# Altium schematic sheet EntradasAnalogicas.SchDoc
size A4; SheetNumber: 7; SheetTotal: 8
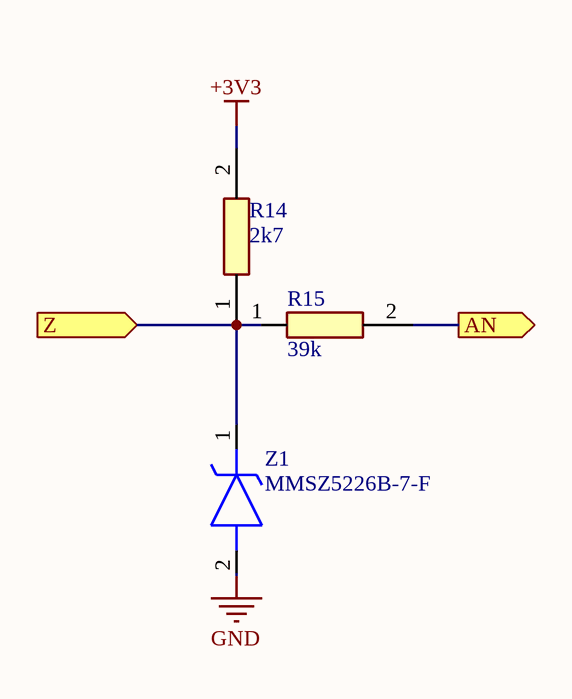
[diagram p0: EntradasAnalogicas.SchDoc]

## Parts
R14  2k7  [RESC3216X75N]
R15  39k  [RESC3216X75N]
Z1  MMSZ5226B-7-F  [MMSZ5226B7F]

## Ports
AN (out), Z (in)

## Nets
+3V3: R14.2
GND: Z1.2(A)
AN: R15.2 ; port AN
Z: R14.1 R15.1 Z1.1(K) ; port Z

## Library data of the parts
R14 R15 = CR1206-F_-2R00ELF: Resistor; Manufacturer_Name: Bourns; Manufacturer_Part_Number: CR1206-F/-2R00ELF; Height: 0.75mm; Mouser Part Number: 652-CR1206-F/2R00ELF; Mouser Price/Stock: https://www.mouser.co.uk/ProductDetail/Bourns/CR1206-F-2R00ELF?qs=W%2FMpXkg%252BdQ47Z%2FeZv1nDSg%3D%3D
Z1 = MMSZ5226B-7-F: Zener Diode; Manufacturer_Name: Diodes Inc.; Datasheet Link: https://www.arrow.com/en/products/mmsz5226b-7-f/diodes-incorporated; Height: 1.45mm; Manufacturer_Part_Number: MMSZ5226B-7-F; Mouser Part Number: 621-MMSZ5226B-F; Mouser Price/Stock: https://www.mouser.co.uk/ProductDetail/Diodes-Incorporated/MMSZ5226B-7-F?qs=KJYV4z76NkUw6Rc9yJaACw%3D%3D; Arrow Part Number: MMSZ5226B-7-F; Arrow Price/Stock: https://www.arrow.com/en/products/mmsz5226b-7-f/diodes-incorporated?region=europe